# Altium project Wiring Harness 2019.PrjPcb
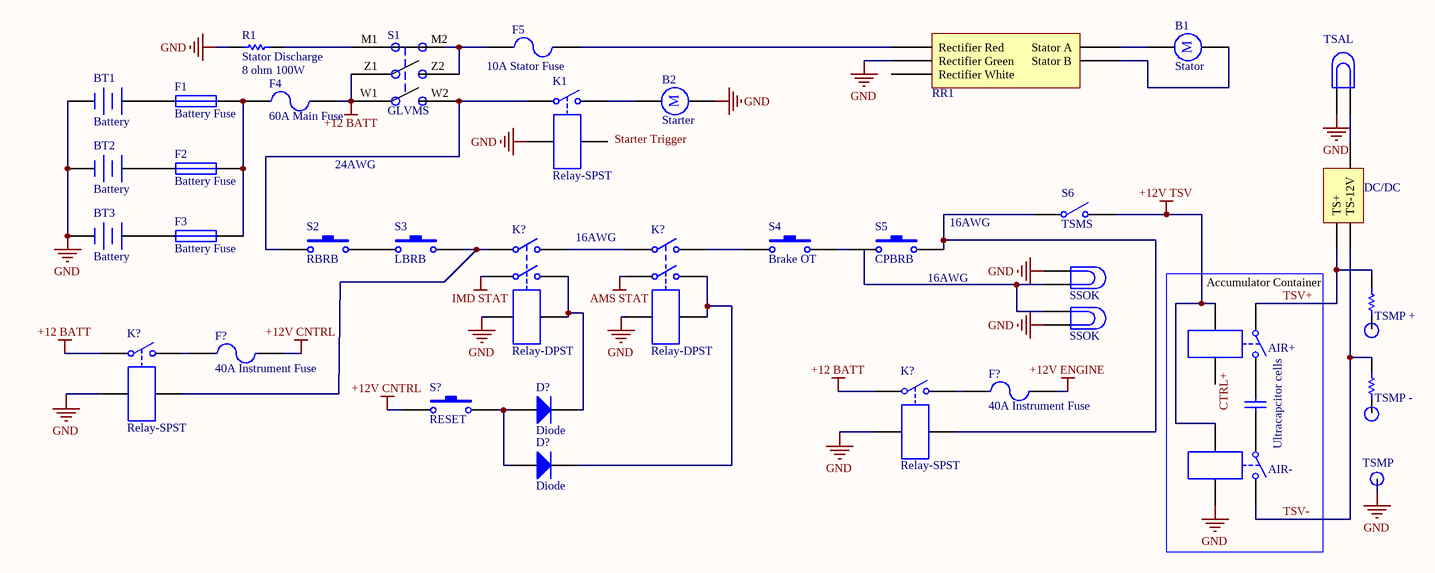
[diagram p0: Master Diagram.SchDoc]
3 sheets, 65 parts. Net scope: flat (ports and power ports of the same name join across sheets).
Sheets:
  Master Diagram.SchDoc
  VD Sensors.SchDoc
  TS.SchDoc

## Sheet Master Diagram.SchDoc
size Letter

### Parts
(Parts that share a designator on the sheet are numbered #1, #2 ... from top to bottom, then left to right.)
B1  Stator  [RB5-10.5]
B2  Starter  [RB5-10.5]
BT1  Battery  [BAT-2]
BT2  Battery  [BAT-2]
BT3  Battery  [BAT-2]
C1  Ultracapcitor cells  [RAD-0.3]
D?#1  Diode  [SMC]
D?#2  Diode  [SMC]
DS1  SSOK  [PIN2]
DS2  SSOK  [PIN2]
DS3#1  TSAL  [PIN2]
F1  Battery Fuse  [PIN-W2/E2.8]
F2  Battery Fuse  [PIN-W2/E2.8]
F3  Battery Fuse  [PIN-W2/E2.8]
F4  60A Main Fuse  [PIN-W2/E2.8]
F5  10A Stator Fuse  [PIN-W2/E2.8]
F?#1  40A Instrument Fuse  [PIN-W2/E2.8]
F?#2  40A Instrument Fuse  [PIN-W2/E2.8]
K1  Relay-SPST  [MODULE4]
K3  AIR+  [MODULE4]
K4  AIR-  [MODULE4]
K?#1  Relay-DPST  [MODULE6]
K?#2  Relay-DPST  [MODULE6]
K?#3  Relay-SPST  [MODULE4]
K?#4  Relay-SPST  [MODULE4]
P?  DC/DC  [4Pin Molex]
R1  Stator Discharge  value 8 ohm 100W  [AXIAL-0.3]
R5  Res1  [AXIAL-0.3]  (value not drawn)
R?  Res1  [AXIAL-0.3]  (value not drawn)
RR1  Regulator Rectifier  (value not drawn)
S1  GLVMS
S2  RBRB  [SPST-2]
S3  LBRB  [SPST-2]
S4  Brake OT  [SPST-2]
S5  CPBRB  [SPST-2]
S6  TSMS  [SPST-2]
S?  RESET  [SPST-2]

### Nets
+12 BATT: F4.2 K?#3.1 K?#4.1 S1.W1 S1.Z1
+12V CNTRL: F?#1.1 S?.1
+12V ENGINE: F?#2.1
+12V TSV: K3.3 K4.3 S6.2(NO)
AMS STAT: K?#2.3
GND: B2.2 BT1.2(-) BT2.2(-) BT3.2(-) DS1.1 DS2.2 DS3#1.2 K1.3 K4.4 K?#1.5 K?#2.5 K?#3.3 K?#4.3 R1.1 RR1.10(Rectifier_Green)
IMD STAT: K?#1.3
TSV+: K3.1 P?.4(TS+) R?.2
TSV-: K4.2 P?.2(TS-) R5.2
NetB1_1: B1.1 RR1.7(Stator_A)
NetB1_2: B1.2 RR1.8(Stator_B)
NetB2_1: B2.1 K1.2
NetBT1_1: BT1.1(+) F1.1
NetBT2_1: BT2.1(+) F2.1
NetBT3_1: BT3.1(+) F3.1
NetC1_1: C1.1 K4.1
NetC1_2: C1.2 K3.2
NetD?#1_1: D?#1.1(A) D?#2.1(A) S?.2
NetD?#1_2: D?#1.2(K) K?#1.4 K?#1.6
NetD?#2_2: D?#2.2(K) K?#2.4 K?#2.6
NetDS1_2: DS1.2 DS2.1
NetDS3#1_1: DS3#1.1 P?.1(12V)
NetF1_2: F1.2 F2.2 F3.2 F4.1
NetF5_1: F5.1 S1.M2 S1.Z2
NetF5_2: F5.2 RR1.9(Rectifier_Red)
NetF?#1_2: F?#1.2 K?#3.2
NetF?#2_2: F?#2.2 K?#4.2
NetK1_1: K1.1 S1.W2 S2.1
NetK?#1_1: K?#1.1 K?#3.4 S3.2
NetK?#1_2: K?#1.2 K?#2.1
NetK?#2_2: K?#2.2 S4.1
NetK?#4_4: K?#4.4 S5.2 S6.1(COMMON)
NetR1_2: R1.2 S1.M1
NetS4_2: S4.2 S5.1

Not connected (* = marked no-connect by the designer): K1 4; K3 4; P? 3; R5 1; R? 1; RR1 11(Rectifier_White); S2 2; S3 1

### Notes on the sheet
- 24AWG
- (near K?#1) 16AWG
- (near S5) 16AWG
- (near R?) TSMP +
- TSMP
- (near R5) TSMP -
- Accumulator Container
- Labels drawn without touching a wire or pin: CTRL+, Starter Trigger
- (in symbol Motor) M

### Library data of the parts
B1 B2 = Motor: Motor, General Kind; Published: 24-Mar-1999; LatestRevisionDate: 17-Jul-2002; LatestRevisionNote: Re-released for DXP Platform.; PackageReference: RB5-10.5; Publisher: Altium Limited; PackageDescription: Capacitor (Radial); 2 Leads
BT1-BT3 = Battery: Multicell Battery; Published: 24-Mar-1999; LatestRevisionDate: 17-Jul-2002; LatestRevisionNote: Re-released for DXP Platform.; PackageReference: BAT-2; Publisher: Altium Limited; PackageDescription: Battery; 2 Leads
C1 = Cap: Capacitor; Value: 100pF; Published: 8-Jun-2000; LatestRevisionDate: 17-Jul-2002; LatestRevisionNote: Re-released for DXP Platform.; PackageReference: RAD-0.3; Publisher: Altium Limited; PackageDescription: Radial Cap, Thru-Hole; 2 Leads; 0.3 in Pin Spacing
D?#1 D?#2 = Diode: Default Diode; Published: 8-Jun-2000; LatestRevisionDate: 17-Jul-2002; LatestRevisionNote: Re-released for DXP Platform.; PackageVersion: Sep-1996; PackageReference: SMC; Publisher: Altium Limited; PackageDescription: DO-214-AB/SMC; 2 C-Bend Leads; Body 7.9 x 5.9 mm, inc. leads (LxW); Code_JEDEC: DO-214-AB
DS1 DS2 DS3#1 = Lamp: Incandescent Bulb; Published: 24-Mar-1999; LatestRevisionDate: 17-Jul-2002; LatestRevisionNote: Re-released for DXP Platform.; PackageReference: PIN2; Publisher: Altium Limited
F1-F3 = Fuse 1: Fuse; Published: 8-Jun-2000; LatestRevisionDate: 17-Jul-2002; LatestRevisionNote: Re-released for DXP Platform.; PackageReference: PIN-W2/E2.8; Publisher: Altium Limited; PackageDescription: Thru-Hole; 2 Leads
F4 F5 F?#1 F?#2 = Fuse 2: Fuse; Published: 8-Jun-2000; LatestRevisionDate: 17-Jul-2002; LatestRevisionNote: Re-released for DXP Platform.; PackageReference: PIN-W2/E2.8; Publisher: Altium Limited; PackageDescription: Thru-Hole; 2 Leads
K1 K3 K4 K?#3 K?#4 = Relay-SPST: Single-Pole Single-Throw Relay; Published: 24-Mar-1999; LatestRevisionDate: 17-Jul-2002; LatestRevisionNote: Re-released for DXP Platform.; PackageReference: MODULE4; Publisher: Altium Limited
K?#1 K?#2 = Relay-DPST: Dual-Pole Single-Throw Relay; Published: 24-Mar-1999; LatestRevisionDate: 17-Jul-2002; LatestRevisionNote: Re-released for DXP Platform.; PackageReference: MODULE6; Publisher: Altium Limited
P? = 4Pin Molex: Supplier Part Number: WM3801-ND
R1 = Res1: Resistor; Published: 8-Jun-2000; LatestRevisionDate: 17-Jul-2002; LatestRevisionNote: Re-released for DXP Platform.; PackageReference: AXIAL-0.3; Publisher: Altium Limited; PackageDescription: Axial Device, Thru-Hole; 2 Leads; 0.3 in Pin Spacing
R5 R? = Res1: Resistor; Value: 1K; Published: 8-Jun-2000; LatestRevisionDate: 17-Jul-2002; LatestRevisionNote: Re-released for DXP Platform.; PackageReference: AXIAL-0.3; Publisher: Altium Limited; PackageDescription: Axial Device, Thru-Hole; 2 Leads; 0.3 in Pin Spacing
RR1 = Stator Rectifier
S2-S5 S? = SW-PB: Switch; Published: 24-Mar-1999; LatestRevisionDate: 17-Jul-2002; LatestRevisionNote: Re-released for DXP Platform.; PackageReference: SPST-2; Publisher: Altium Limited; PackageDescription: Switch; 2 Leads
S6 = SW-SPST: Single-Pole, Single-Throw Switch; Published: 24-Mar-1999; LatestRevisionDate: 17-Jul-2002; LatestRevisionNote: Re-released for DXP Platform.; PackageReference: SPST-2; Publisher: Altium Limited; PackageDescription: Switch; 2 Leads

## Sheet VD Sensors.SchDoc
size A4
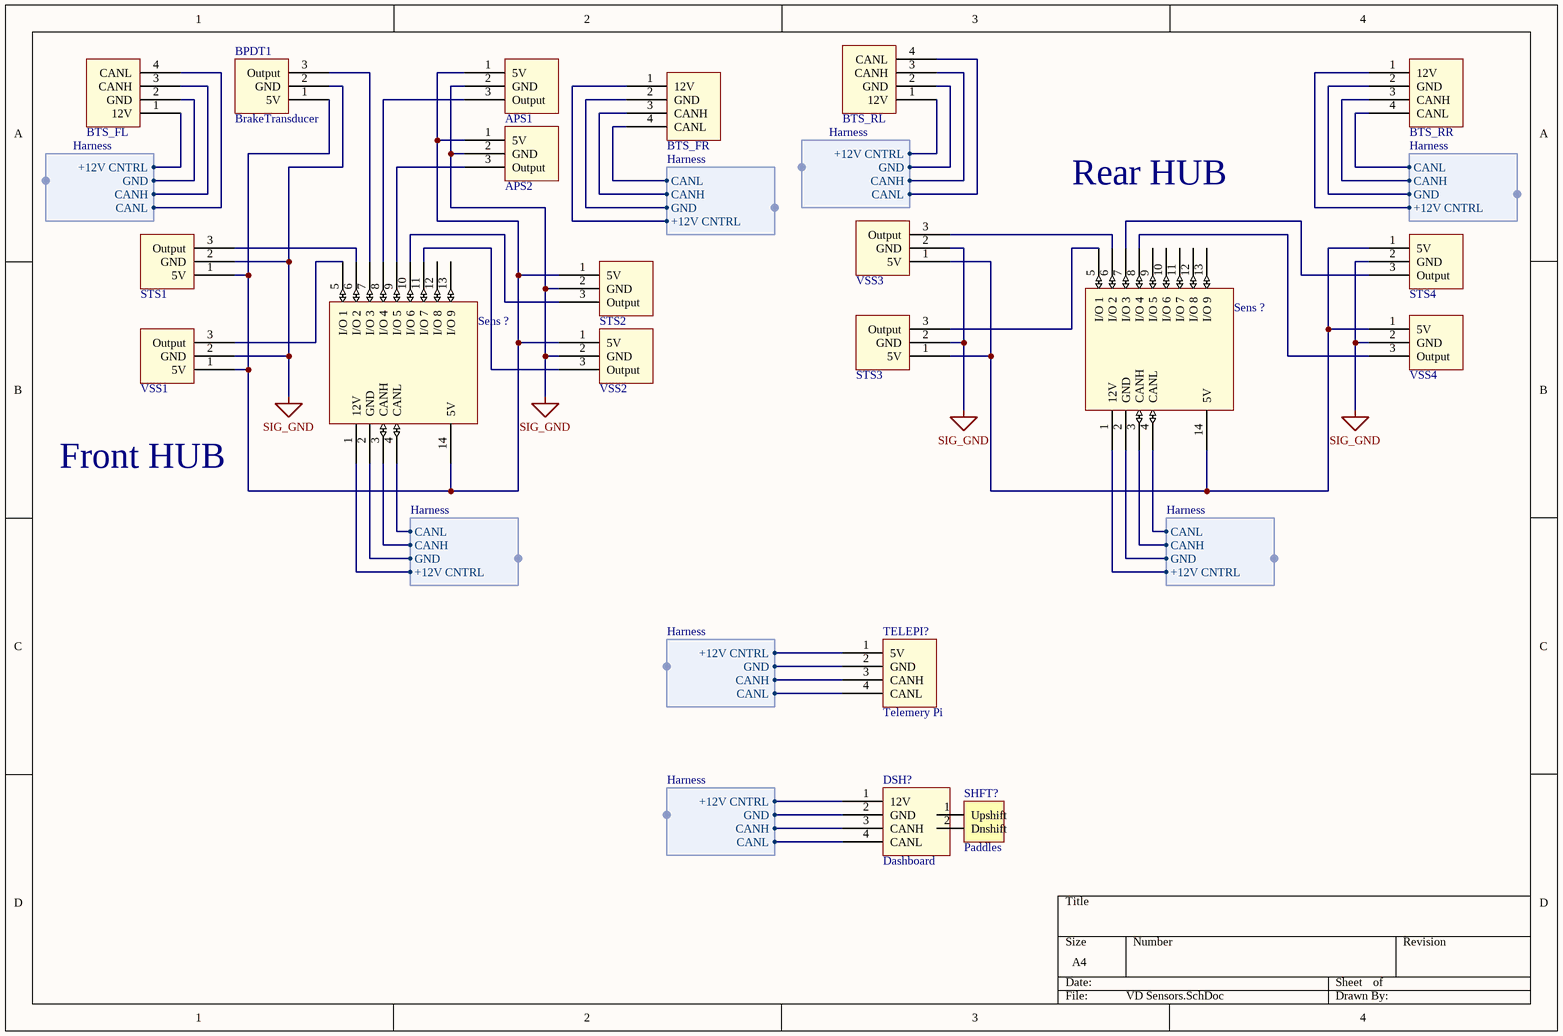
[diagram p1: VD Sensors.SchDoc]

### Parts
(Parts that share a designator on the sheet are numbered #1, #2 ... from top to bottom, then left to right.)
APS1  APS  (value not drawn)
APS2  APS  (value not drawn)
BPDT1  BrakeTransducer
BTS_FL  BTS  (value not drawn)
BTS_FR  BTS  (value not drawn)
BTS_RL  BTS  (value not drawn)
BTS_RR  BTS  (value not drawn)
DSH?  Dashboard
Sens_?#1  CanSensHub  (value not drawn)
Sens_?#2  CanSensHub  (value not drawn)
SHFT?  Paddles  [HDR1X2]
STS1  Susp  (value not drawn)
STS2  Susp  (value not drawn)
STS3  Susp  (value not drawn)
STS4  Susp  (value not drawn)
TELEPI?  Telemery Pi
VSS1  VSS  (value not drawn)
VSS2  VSS  (value not drawn)
VSS3  VSS  (value not drawn)
VSS4  VSS  (value not drawn)

### Harnesses
Harness: +12V CNTRL, GND, CANH, CANL

### Nets
SIG_GND: APS1.2(GND) APS2.2(GND) BPDT1.2(GND) STS1.2(GND) STS2.2(GND) STS3.2(GND) STS4.2(GND) VSS1.2(GND) VSS2.2(GND) VSS3.2(GND) VSS4.2(GND)
NetAPS1_1: APS1.1(5V) APS2.1(5V) BPDT1.1(5V) Sens_?#2.14(5V) STS1.1(5V) STS2.1(5V) VSS1.1(5V) VSS2.1(5V)
NetAPS1_3: APS1.3(Output) Sens_?#2.8(I/O_4)
NetAPS2_3: APS2.3(Output) Sens_?#2.9(I/O_5)
NetBPDT1_3: BPDT1.3(Output) Sens_?#2.7(I/O_3)
NetBTS_FL_1: BTS_FL.1(12V) ; harness Harness.+12V CNTRL
NetBTS_FL_2: BTS_FL.2(GND) ; harness Harness.GND
NetBTS_FL_3: BTS_FL.3(CANH) ; harness Harness.CANH
NetBTS_FL_4: BTS_FL.4(CANL) ; harness Harness.CANL
NetBTS_FR_1: BTS_FR.1(12V) ; harness Harness.+12V CNTRL
NetBTS_FR_2: BTS_FR.2(GND) ; harness Harness.GND
NetBTS_FR_3: BTS_FR.3(CANH) ; harness Harness.CANH
NetBTS_FR_4: BTS_FR.4(CANL) ; harness Harness.CANL
NetBTS_RL_1: BTS_RL.1(12V) ; harness Harness.+12V CNTRL
NetBTS_RL_2: BTS_RL.2(GND) ; harness Harness.GND
NetBTS_RL_3: BTS_RL.3(CANH) ; harness Harness.CANH
NetBTS_RL_4: BTS_RL.4(CANL) ; harness Harness.CANL
NetBTS_RR_1: BTS_RR.1(12V) ; harness Harness.+12V CNTRL
NetBTS_RR_2: BTS_RR.2(GND) ; harness Harness.GND
NetBTS_RR_3: BTS_RR.3(CANH) ; harness Harness.CANH
NetBTS_RR_4: BTS_RR.4(CANL) ; harness Harness.CANL
NetDSH?_1: DSH?.1(12V) ; harness Harness.+12V CNTRL
NetDSH?_2: DSH?.2(GND) ; harness Harness.GND
NetDSH?_3: DSH?.3(CANH) ; harness Harness.CANH
NetDSH?_4: DSH?.4(CANL) ; harness Harness.CANL
NetSens_?#1_1: Sens_?#1.1(12V) ; harness Harness.+12V CNTRL
NetSens_?#1_2: Sens_?#1.2(GND) ; harness Harness.GND
NetSens_?#1_3: Sens_?#1.3(CANH) ; harness Harness.CANH
NetSens_?#1_4: Sens_?#1.4(CANL) ; harness Harness.CANL
NetSens_?#1_5: Sens_?#1.5(I/O_1) STS3.3(Output)
NetSens_?#1_6: Sens_?#1.6(I/O_2) VSS3.3(Output)
NetSens_?#1_7: Sens_?#1.7(I/O_3) STS4.3(Output)
NetSens_?#1_8: Sens_?#1.8(I/O_4) VSS4.3(Output)
NetSens_?#1_14: Sens_?#1.14(5V) STS3.1(5V) STS4.1(5V) VSS3.1(5V) VSS4.1(5V)
NetSens_?#2_1: Sens_?#2.1(12V) ; harness Harness.+12V CNTRL
NetSens_?#2_2: Sens_?#2.2(GND) ; harness Harness.GND
NetSens_?#2_3: Sens_?#2.3(CANH) ; harness Harness.CANH
NetSens_?#2_4: Sens_?#2.4(CANL) ; harness Harness.CANL
NetSens_?#2_5: Sens_?#2.5(I/O_1) VSS1.3(Output)
NetSens_?#2_6: Sens_?#2.6(I/O_2) STS1.3(Output)
NetSens_?#2_10: Sens_?#2.10(I/O_6) STS2.3(Output)
NetSens_?#2_11: Sens_?#2.11(I/O_7) VSS2.3(Output)
NetTELEPI?_1: TELEPI?.1(5V) ; harness Harness.+12V CNTRL
NetTELEPI?_2: TELEPI?.2(GND) ; harness Harness.GND
NetTELEPI?_3: TELEPI?.3(CANH) ; harness Harness.CANH
NetTELEPI?_4: TELEPI?.4(CANL) ; harness Harness.CANL

Not connected (* = marked no-connect by the designer): Sens_?#1 9(I/O_5) 10(I/O_6) 11(I/O_7) 12(I/O_8) 13(I/O_9); Sens_?#2 12(I/O_8) 13(I/O_9); SHFT? 1(Upshift) 2(Dnshift)

### Notes on the sheet
- Rear HUB
- Front HUB

### Library data of the parts
APS1 APS2 = APS: Accelerator Pedal Sensor
BPDT1 = BrakeTransducer: Brake Pressure Transducer
BTS_FL BTS_FR BTS_RL BTS_RR = BTS: Brake Temperature Sensor
DSH? = Dash: Dashboard Connector
Sens_?#1 Sens_?#2 = Sensor Hub: Canduino Sensor Hub
SHFT? = Header 2: Header, 2-Pin; LatestRevisionDate: 17-Jul-2002; LatestRevisionNote: Re-released for DXP Platform.; Publisher: Altium Limited
STS1-STS4 = VSS: Suspension Travel Sensor
TELEPI? = TELEPI: Raspberry Pi used for telemetry
VSS1-VSS4 = VSS: Vehicle Speed Sensor

## Sheet TS.SchDoc
size A4
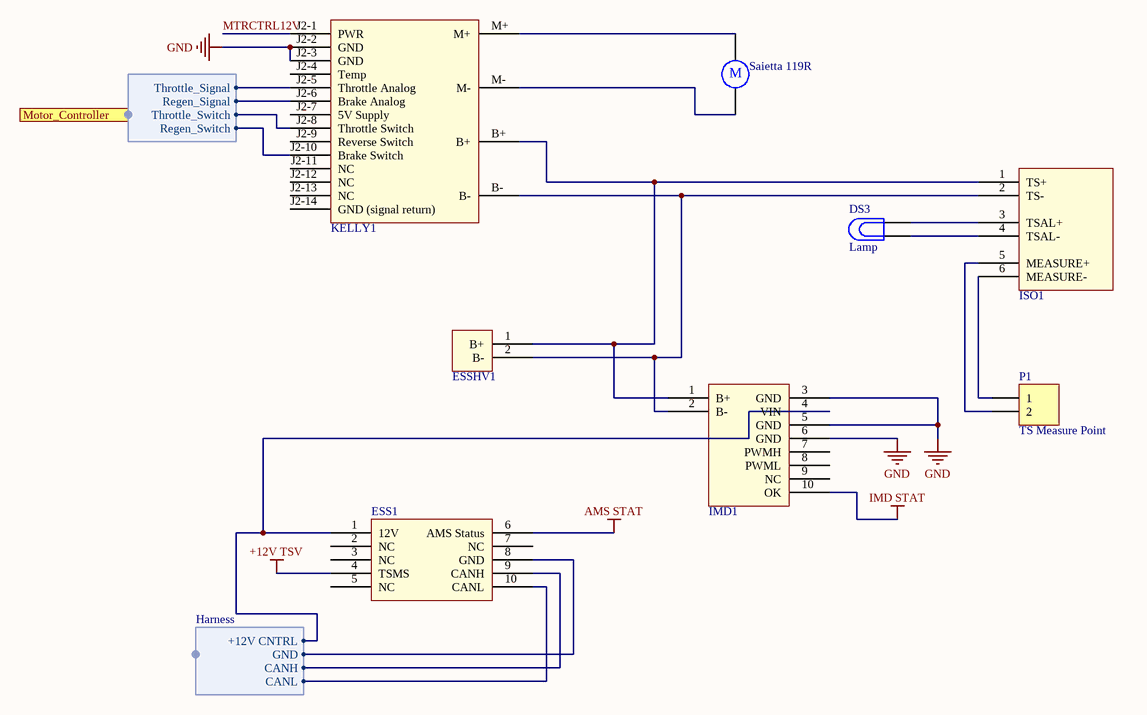
[diagram p2: TS.SchDoc]

### Parts
(Parts that share a designator on the sheet are numbered #1, #2 ... from top to bottom, then left to right.)
B4  Saietta 119R  [RB5-10.5]
DS3#2  Lamp  [PIN2]
ESS1  (no value)
ESSHV1  ESS High Voltage  (value not drawn)
IMD1  IMD  (value not drawn)
ISO1  Isolation Board  (value not drawn)
KELLY1  Kelly MC  (value not drawn)
P1  TS Measure Point  [HDR1X2]

### Ports
Motor_Controller (harness Motor Controller)

### Harnesses
Motor Controller: Throttle_Signal, Regen_Signal, Throttle_Switch, Regen_Switch
Harness: +12V CNTRL, GND, CANH, CANL

### Nets
+12V TSV: ESS1.4(TSMS)
AMS STAT: ESS1.6(AMS_Status)
GND: IMD1.3(GND) IMD1.5(GND) IMD1.6(GND) KELLY1.J2-2(GND) KELLY1.J2-3(GND)
IMD STAT: IMD1.10(OK)
MTRCTRL12V: KELLY1.J2-1(PWR)
NetB4_1: B4.1 KELLY1.M+
NetB4_2: B4.2 KELLY1.M-
NetDS3#2_1: DS3#2.1 ISO1.4(TSAL-)
NetDS3#2_2: DS3#2.2 ISO1.3(TSAL+)
NetESS1_1: ESS1.1(12V) IMD1.4(VIN) ; harness Harness.+12V CNTRL
NetESS1_8: ESS1.8(GND) ; harness Harness.GND
NetESS1_9: ESS1.9(CANH) ; harness Harness.CANH
NetESS1_10: ESS1.10(CANL) ; harness Harness.CANL
NetESSHV1_1: ESSHV1.1(B+) IMD1.1(B+) ISO1.1(TS+) KELLY1.B+
NetESSHV1_2: ESSHV1.2(B-) IMD1.2(B-) ISO1.2(TS-) KELLY1.B-
NetISO1_5: ISO1.5(MEASURE+) P1.2
NetISO1_6: ISO1.6(MEASURE-) P1.1
NetKELLY1_J2-5: KELLY1.J2-5(Throttle_Analog) ; port Motor_Controller.Throttle_Signal
NetKELLY1_J2-6: KELLY1.J2-6(Brake_Analog) ; port Motor_Controller.Regen_Signal
NetKELLY1_J2-8: KELLY1.J2-8(Throttle_Switch) ; port Motor_Controller.Throttle_Switch
NetKELLY1_J2-10: KELLY1.J2-10(Brake_Switch) ; port Motor_Controller.Regen_Switch

Not connected (* = marked no-connect by the designer): ESS1 2(NC) 3(NC) 5(NC) 7(NC); IMD1 7(PWMH) 8(PWML) 9(NC); KELLY1 J2-4(Temp) J2-7(5V_Supply) J2-9(Reverse_Switch) J2-11(NC) J2-12(NC) J2-13(NC) J2-14(GND_(signal_return))

### Notes on the sheet
- (in symbol Motor) M

### Library data of the parts
B4 = Motor: Motor, General Kind; Published: 24-Mar-1999; LatestRevisionDate: 17-Jul-2002; LatestRevisionNote: Re-released for DXP Platform.; PackageReference: RB5-10.5; Publisher: Altium Limited; PackageDescription: Capacitor (Radial); 2 Leads
DS3#2 = Lamp: Incandescent Bulb; Published: 24-Mar-1999; LatestRevisionDate: 17-Jul-2002; LatestRevisionNote: Re-released for DXP Platform.; PackageReference: PIN2; Publisher: Altium Limited
ESS1 = ESS 10pin
ESSHV1 = ESS HV
IMD1 = IMD: Insulation Monitoring Device
ISO1 = ISO
KELLY1 = Kelly HPM: Kelly KPM 12601 Functional Pinout
P1 = Header 2: Header, 2-Pin; LatestRevisionDate: 17-Jul-2002; LatestRevisionNote: Re-released for DXP Platform.; Publisher: Altium Limited

## Nets that join several sheets
+12V TSV: Master Diagram (K3.3 K4.3 S6.2), TS (ESS1.4)
AMS STAT: Master Diagram (K?#2.3), TS (ESS1.6)
GND: Master Diagram (15 pins), TS (5 pins)
IMD STAT: Master Diagram (K?#1.3), TS (IMD1.10)